# EAGLE design onekeyboard (EAGLE 7.6.0)
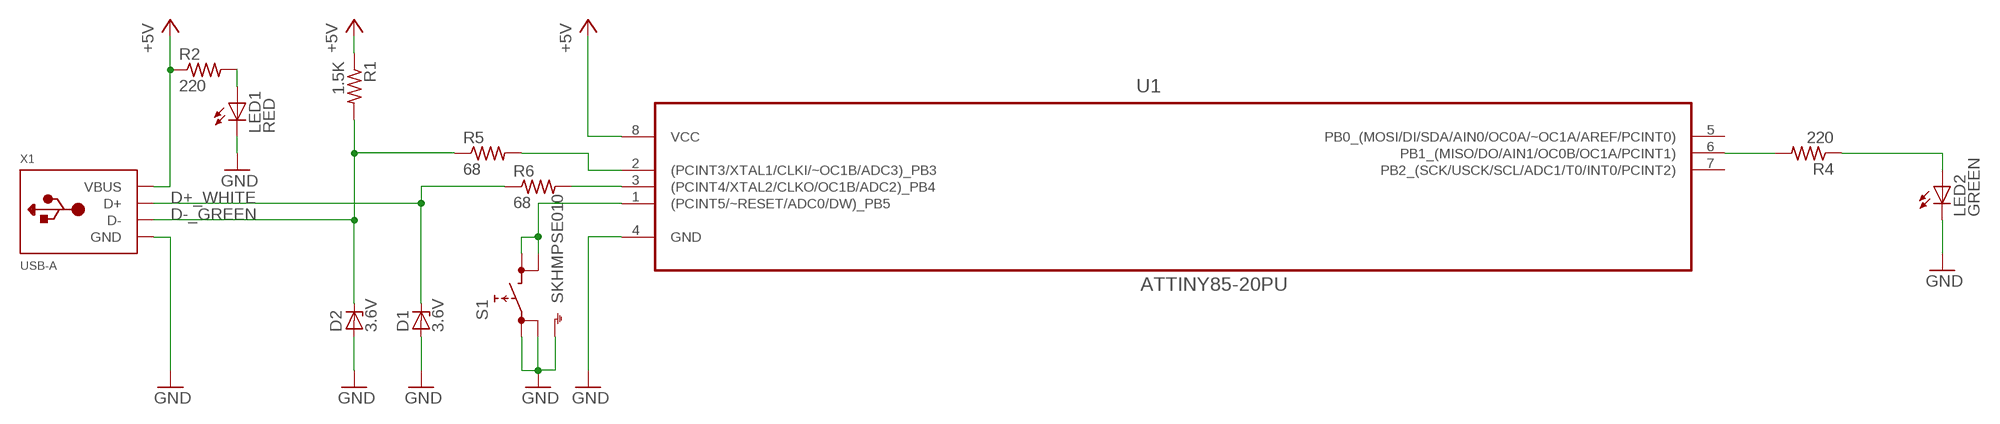
[diagram p0: schematic, sheet 1]

## Parts
D1  3.6V  1N4728  [DO41Z10]
D2  3.6V  1N4728  [DO41Z10]
LED1  RED  LED5MM  [LED5MM]
LED2  GREEN  LED5MM  [LED5MM]
R1  1.5K  R-US_0204/5  [0204/5]
R2  220  R-US_0204/5  [0204/5]
R4  220  R-US_0204/5  [0204/5]
R5  68  R-US_R0402  [R0402]
R6  68  R-US_R0402  [R0402]
S1  SKHMPSE010  [SKHMPXE010]
U1  ATTINY85-20PU  [DIP254P762X533-8]
X1  USB-A  [MOLEX_480371000]

## Nets
+5V: R1.1 R2.1 U1.8(VCC) X1.1(VBUS)
D+_WHITE: D1.C R6.1 X1.3(D+)
D-_GREEN: D2.C R1.2 R5.1 X1.2(D-)
GND: D1.A D2.A LED1.K(C) LED2.K(C) S1.1(1.1) S1.2(1.2) S1.5(SH) U1.4(GND) X1.4(GND)
N$1: R5.2 U1.2((PCINT3/XTAL1/CLKI/~OC1B/ADC3)_PB3)
N$2: R6.2 U1.3((PCINT4/XTAL2/CLKO/OC1B/ADC2)_PB4)
N$3: S1.3(2.1) S1.4(2.2) U1.1((PCINT5/~RESET/ADC0/DW)_PB5)
N$7: R4.2 U1.6(PB1_(MISO/DO/AIN1/OC0B/OC1A/PCINT1))
N$8: LED2.A R4.1
N$9: LED1.A R2.2
Unconnected: U1.5(PB0_(MOSI/DI/SDA/AIN0/OC0A/~OC1A/AREF/PCINT0)) U1.7(PB2_(SCK/USCK/SCL/ADC1/T0/INT0/PCINT2))

## Library data of the parts
D1 D2 = diode:1N4728: Z DIODE 3.3 V, 1W, 5 percent
LED1 LED2 = adafruit:LED: LED OSRAM: - CHIPLED LG R971, LG N971, LY N971, LG Q971, LY Q971, LO R971, LY R971 LH N974, LH R974 LS Q976, LO Q976, LY Q976 LO Q996 - Hyper CHIPLED LW Q18S LB Q993, LB Q99A, LB R99A - SideLED LS A670, LO A670, LY A670, LG A670, LP A670 LB A673, LV A673, LT A673, LW A673 LH A674 LY A675 LS A676, LA A676, LO A676, LY A676, LW A676 LS A679, LY A679, LG A679 - Hyper Micro SIDELED® LS Y876, LA Y876, LO Y876, LY Y876 LT Y87S - SmartLED LW L88C, LW L88S LB L89C, LB L89S, LG L890 LS L89K, LO L89K, LY L89K LS L896, LA L896, LO L896, LY L896 - TOPLED LS T670, LO T670, LY T670, LG T670, LP T670 LSG T670, LSP T670, LSY T670, LOP T670, LYG T670 LG T671, LOG T671, LSG T671 LB T673, LV T673, LT T673, LW T673 LH T674 LS T676, LA T676, LO T676, LY T676, LB T676, LH T676, LSB T676, LW T676 LB T67C, LV T67C, LT T67C, LS T67K, LO T67K, LY T67K, LW E67C LS E67B, LA E67B, LO E67B, LY E67B, LB E67C, LV E67C, LT E67C LW T67C LS T679, LY T679, LG T679 LS T770, LO T770, LY T770, LG T770, LP T770 LB T773, LV T773, LT T773, LW T773 LH T774 LS E675, LA E675, LY E675, LS T675 LS T776, LA T776, LO T776, LY T776, LB T776 LHGB T686 LT T68C, LB T68C - Hyper Mini TOPLED® LB M676 - Mini TOPLED Santana® LG M470 LS M47K, LO M47K, LY M47K Source: http://www.osram.convergy.de/
R1 R2 R4-R6 = rcl:R-US_: RESISTOR, American symbol
S1 = switch:SKHMP*E010: 6.2 X 6.5mm TACT Switch (SMD) Source: http://www3.alps.co.jp/WebObjects/catalog.woa/PDF/E/Switch/Tact/SKHM/SKHM.PDF
U1 = Atmel_By_element14_Batch_1-00:ATTINY85-20PU: 8-bit Microcontroller with In-System Programmable Flash; MPN: ATTINY85-20PU; OC_FARNELL: 1455162; OC_NEWARK: 58M3796; PACKAGE: PDIP-8; SUPPLIER: Atmel
X1 = adafruit:USB-A: USB type A 'plug' Used for things that can directly connect to a USB port, say USB key

## Board
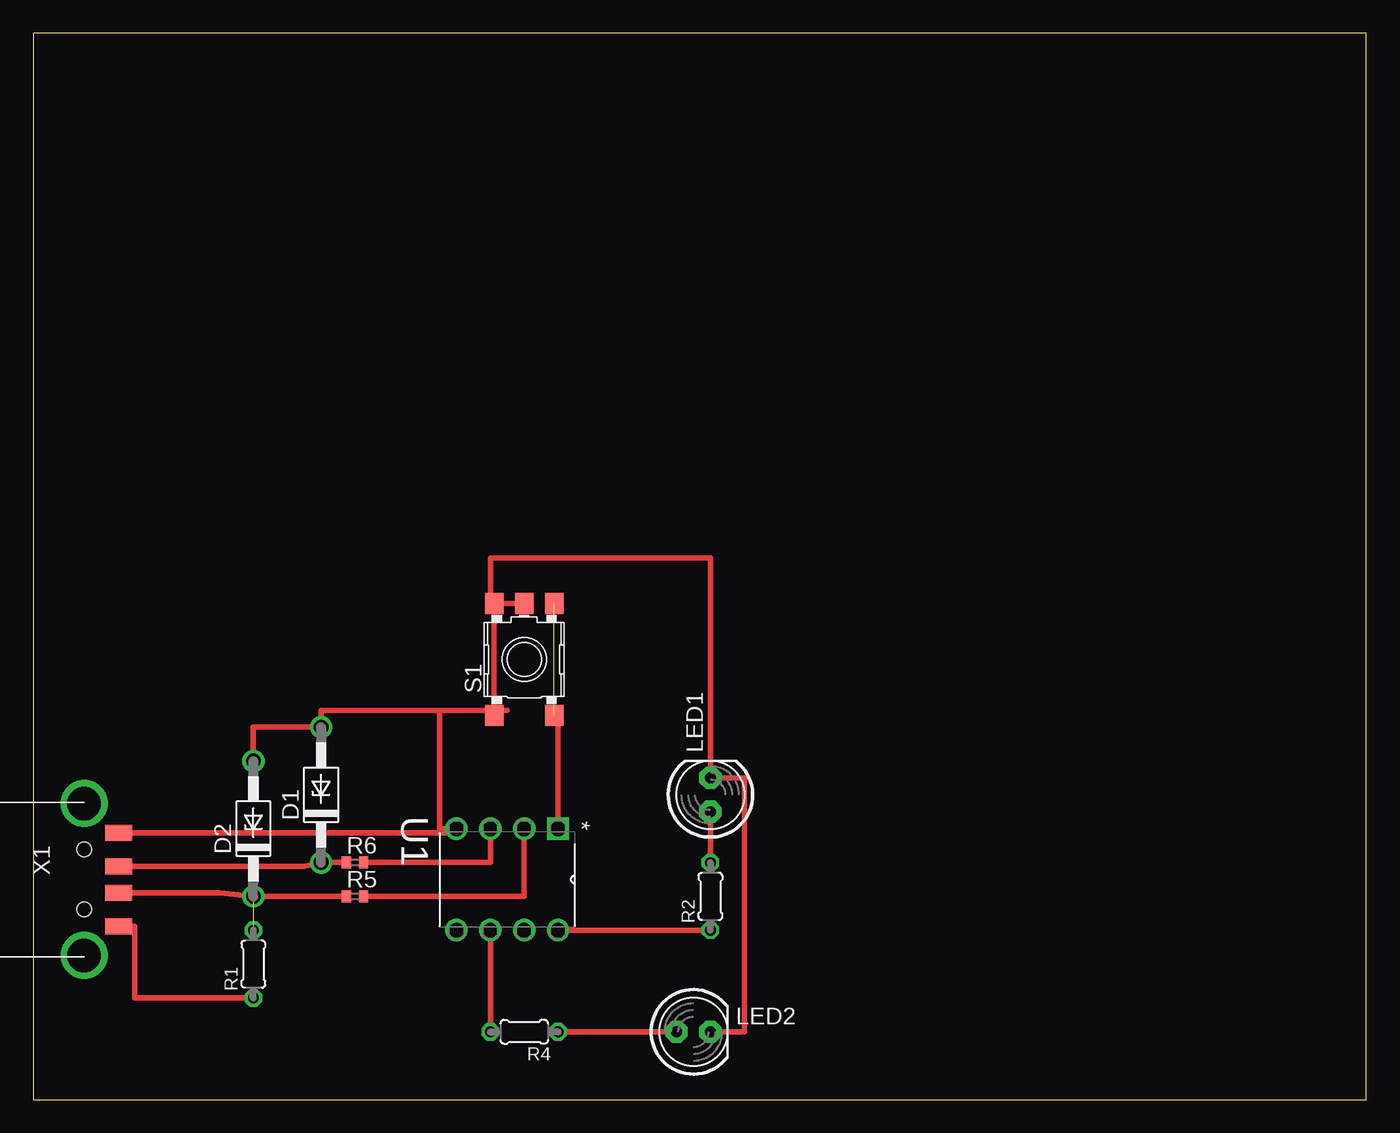
[diagram p1: board, top side]
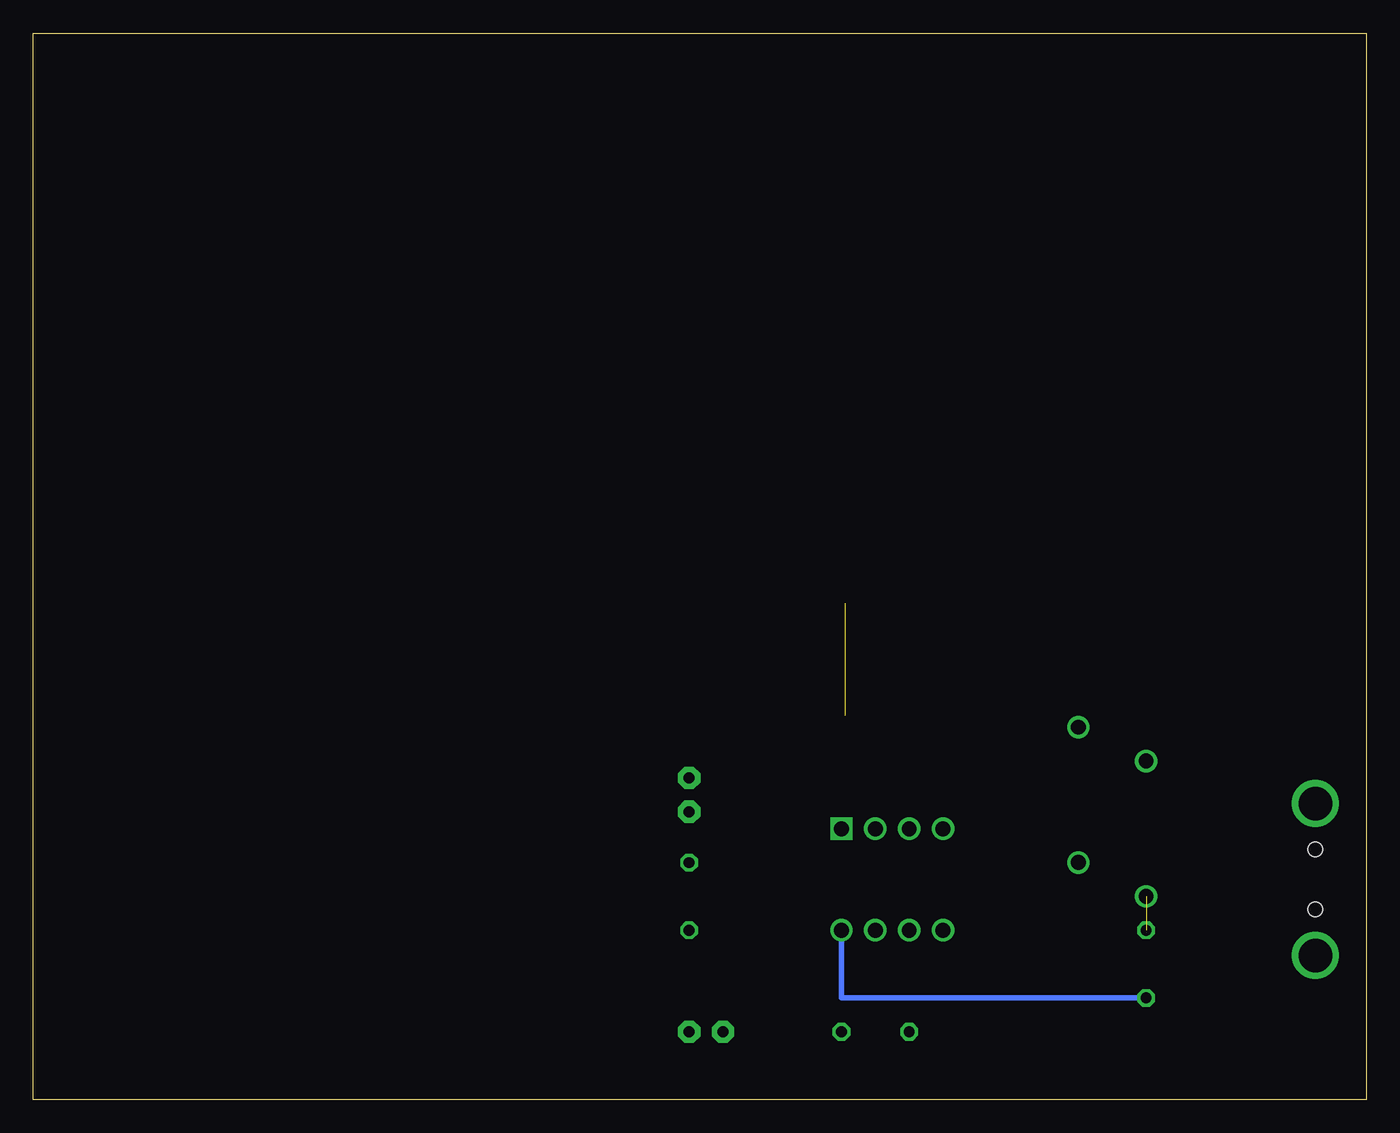
[diagram p2: board, bottom side, seen from below]

Size 100 x 80 mm. Coordinates in mm from the lower left corner, seen from the top.
Outline: 0,0 100,0 100,80 0,80 0,0
Copper layers (1*16): Top 0.035mm / dielectric 1.5mm / Bottom 0.035mm
Design rules "default": minimum track width 10mil, minimum drill 24mil, track to track 8mil, track to pad 8mil, pad to pad 8mil, via to via 8mil, smd to smd 8mil, copper to edge 40mil, drill to drill 8mil, minimum pad ring 10mil, minimum via ring 8mil, stop-mask expansion 4mil, vias tented up to drill 0mil, thermal gap 10mil

### Footprints (pad centres in the part's own frame; a part is rotated, then mirrored left to right if it is on the bottom)
DO41Z10 = drill 1.118: A 5.08,0; C -5.08,0
LED5MM = drill 0.813 pad 1.676 octagon: A -1.27,0; K 1.27,0
0204/5 = drill 0.813 octagon: 1 -2.54,0; 2 2.54,0
R0402 = smd 0.7 x 0.9: 1 -0.65,0; 2 0.65,0
SKHMPXE010 = smd 1.6 x 1.4: 1 -4.2,2.25; 2 4.2,2.25; 3 -4.2,-2.25; 4 4.2,-2.25; 5 4.2,0
DIP254P762X533-8 = drill 1.118 square: 1 -7.62,7.62 | drill 1.118: 2 -7.62,5.08; 3 -7.62,2.54; 4 -7.62,0; 5 0,0; 6 0,2.54; 7 0,5.08; 8 0,7.62
MOLEX_480371000 = smd 1.2 x 2: 1 3.5,2.6; 2 1,2.6; 3 -1,2.6; 4 -3.5,2.6 | drill 2.5: M1 -5.7,0; M2 5.7,0 | hole 1.1: -2.25,0; 2.25,0

### Placement (x,y rotation side)
D1  21.59,22.86 90 top
D2  16.51,20.32 90 top
LED1  50.8,22.86 90 top
LED2  49.53,5.08 0 top
R1  16.51,10.16 90 top
R2  50.8,15.24 90 top
R4  36.83,5.08 180 top
R5  24.13,15.24 0 top
R6  24.13,17.78 0 top
S1  36.83,33.02 90 top
U1  31.75,12.7 270 top
X1  3.81,16.51 270 top

### Tracks (layer width: path | path; a pad name or v marks a point on that pad's centre or on a via)
+5V
  Top 0.406: R2.1 U1.8 | X1.1 7.62,13.01 7.62,7.62 R1.1
  Bottom 0.406: U1.8 39.37,7.62 R1.1
D+_WHITE
  Top 0.406: R6.1 D1.C 20.32,17.51 X1.3
D-_GREEN  (1 unrouted)
  Top 0.406: X1.2 13.97,15.51 D2.C R5.1
GND
  Top 0.406: X1.4 31.75,20.01 U1.4 30.48,20.32 30.48,29.21 | 30.48,29.21 34.58,29.21 | 35.56,29.21 34.58,29.21 | 34.58,29.21 S1.1 S1.2 | 30.48,29.21 21.59,29.21 D1.A 16.51,27.94 D2.A | S1.2 34.29,37.22 34.29,40.64 50.8,40.64 LED1.K 53.34,24.13 53.34,5.08 LED2.K | S1.5 S1.2
N$1
  Top 0.406: R5.2 36.83,15.24 U1.2
N$2
  Top 0.406: U1.3 34.29,17.78 R6.2
N$3  (1 unrouted)
  Top 0.406: S1.3 39.37,28.82 U1.1
N$7
  Top 0.406: R4.2 U1.6
N$8
  Top 0.406: LED2.A R4.1
N$9
  Top 0.406: LED1.A R2.2